# Altium schematic sheet SuperFin Baseboard pg9.SchDoc
size B
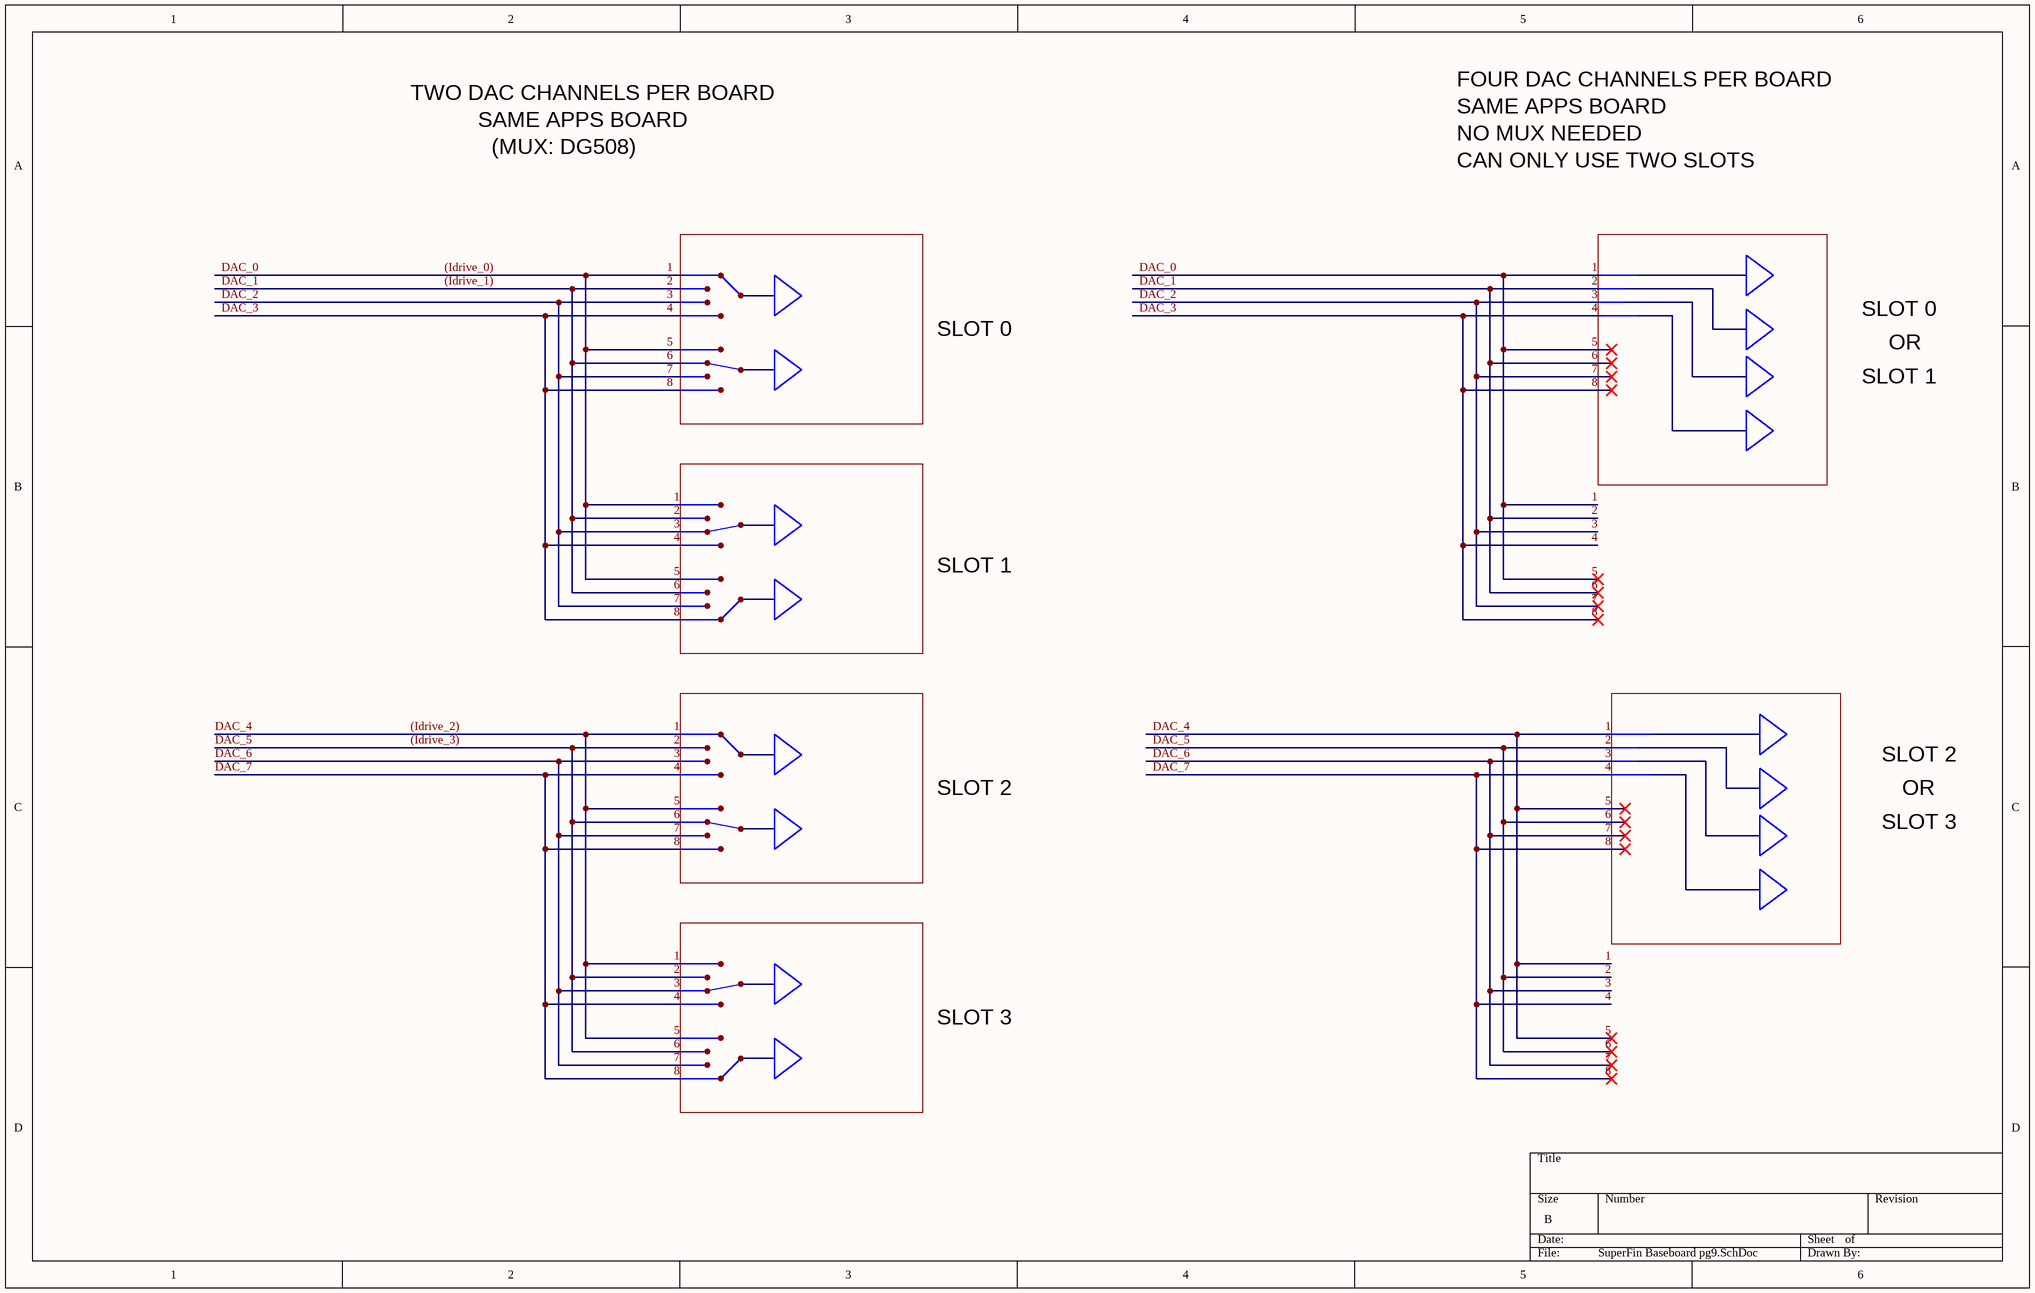
[diagram p0: SuperFin Baseboard pg9.SchDoc]

## Notes on the sheet
- TWO DAC CHANNELS PER BOARD
- FOUR DAC CHANNELS PER BOARD
- SAME APPS BOARD
- (MUX: DG508)
- NO MUX NEEDED
- CAN ONLY USE TWO SLOTS
- SLOT 0
- OR
- SLOT 1
- SLOT 2
- SLOT 3